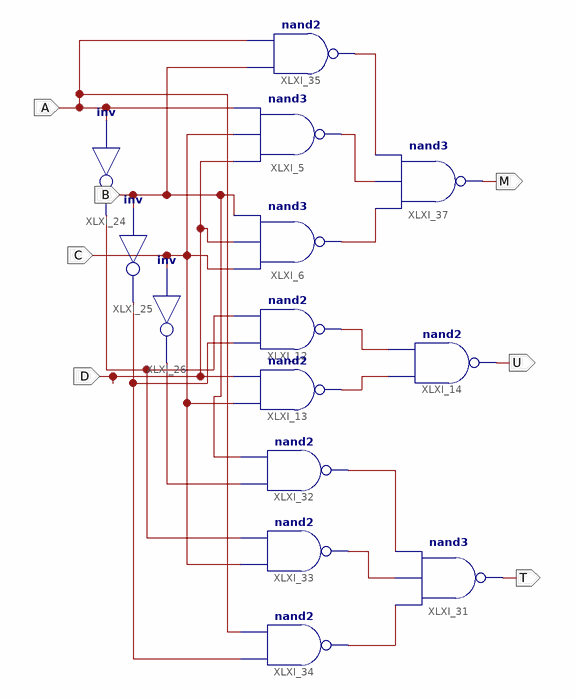
[diagram p0: schematic sheet 1]
// Xilinx ISE schematic Lab_B_Part2_Schematic.sch (artix7) as structural Verilog: 14 symbols, 7 ports
module Lab_B_Part2_Schematic (
  input  C,
  input  D,
  input  A,
  input  B,
  output M,
  output U,
  output T
);

  wire XLXN_3, XLXN_4, XLXN_55, XLXN_56, XLXN_57, XLXN_61, XLXN_62, XLXN_64, XLXN_66, XLXN_67, XLXN_68;

  nand XLXI_5 (XLXN_67, D, C, A);
  nand XLXI_6 (XLXN_66, C, D, B);
  nand XLXI_12 (XLXN_3, XLXN_61, XLXN_62);
  nand XLXI_13 (XLXN_4, C, D);
  nand XLXI_14 (U, XLXN_4, XLXN_3);
  not XLXI_24 (XLXN_62, A);
  not XLXI_25 (XLXN_61, B);
  not XLXI_26 (XLXN_64, C);
  nand XLXI_31 (T, XLXN_57, XLXN_56, XLXN_55);
  nand XLXI_32 (XLXN_55, XLXN_64, B);
  nand XLXI_33 (XLXN_56, C, XLXN_62);
  nand XLXI_34 (XLXN_57, XLXN_61, A);
  nand XLXI_35 (XLXN_68, B, A);
  nand XLXI_37 (M, XLXN_66, XLXN_67, XLXN_68);
endmodule
